# Altium schematic sheet STC12C5A60S2 DEMO R1A.SchDoc
size A3
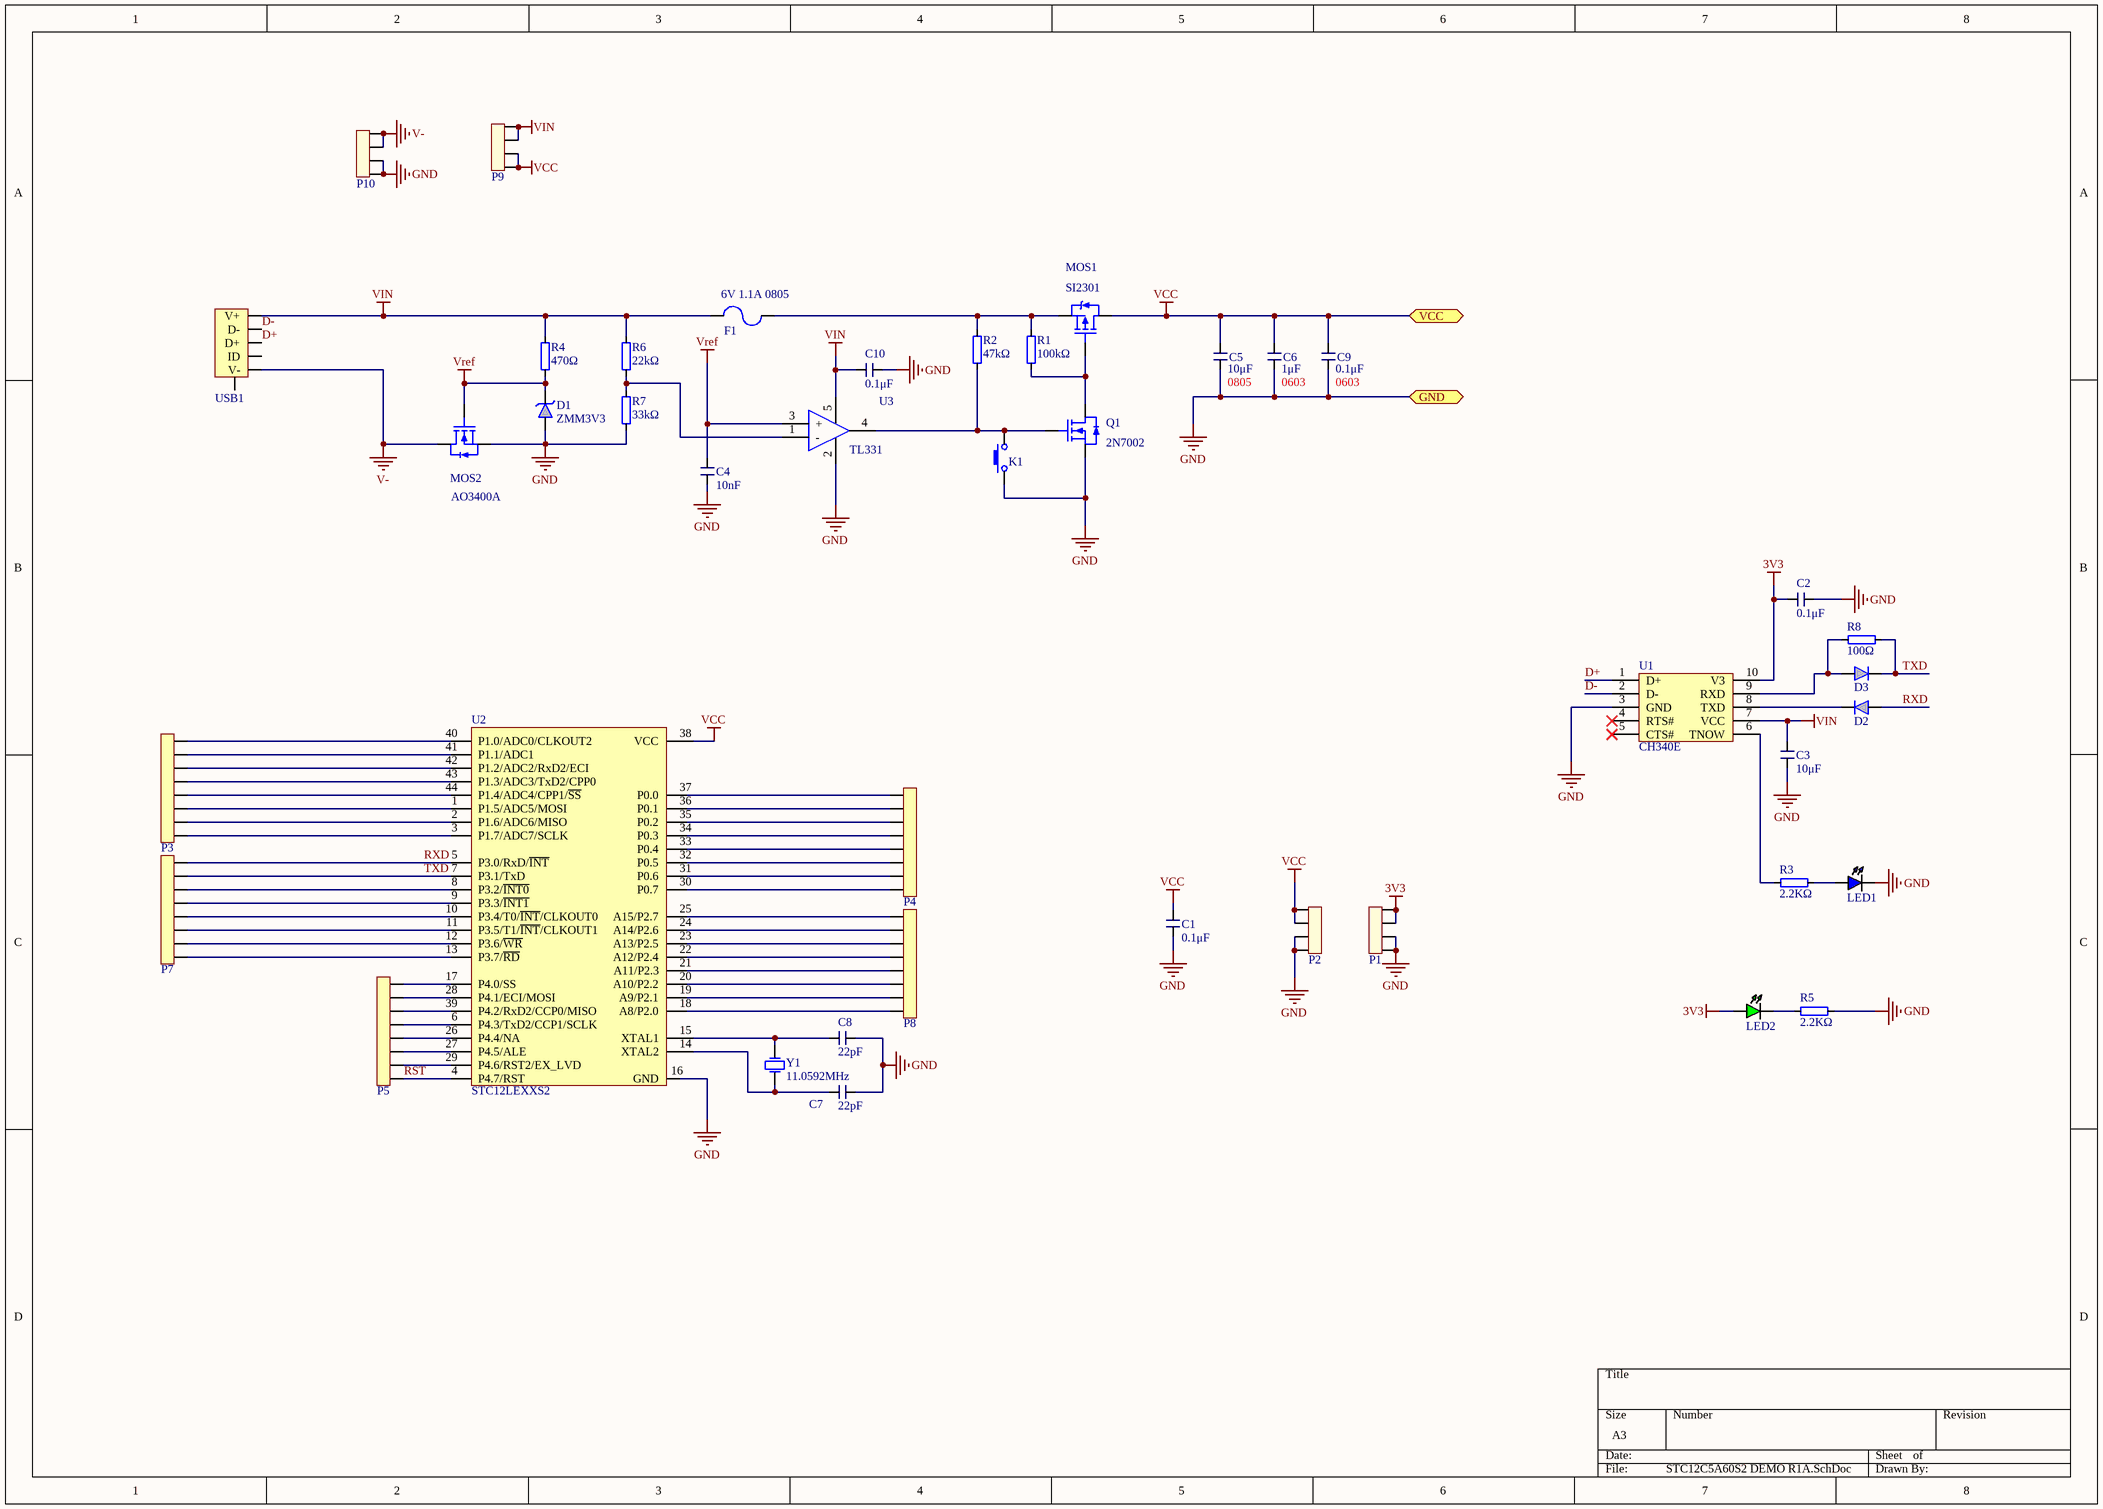
[diagram p0: STC12C5A60S2 DEMO R1A.SchDoc]

## Parts
C1  0.1μF  [C_0603]
C2  0.1μF  [C_0603]
C3  10μF  [C_0603]
C4  10nF  [C_0603]
C5  10μF  [C_0805]
C6  1μF  [C_0603]
C7  22pF  [C_0603]
C8  22pF  [C_0603]
C9  0.1μF  [C_0603]
C10  0.1μF  [C_0603]
D1  ZMM3V3  [SOD_80]
D2  1N4148WS  [SOD_323]  (value not drawn)
D3  1N4148WS  [SOD_323]  (value not drawn)
F1  6V 1.1A 0805  [FB_0805]
K1  TACT SWITCH_2_SMD  [TACT SWITCH_2_SMD]  (value not drawn)
LED1  LED_0603-B  [LED_0603-B]  (value not drawn)
LED2  LED_0603-G  [LED_0603-G]  (value not drawn)
MOS1  SI2301  [SOT_23_3]
MOS2  AO3400A  [SOT_23_3]
P1  PIN4  [PIN_4]  (value not drawn)
P2  PIN4  [PIN_4]  (value not drawn)
P3  PIN8  [PIN_8]  (value not drawn)
P4  PIN8  [PIN_8]  (value not drawn)
P5  PIN8  [PIN_8]  (value not drawn)
P7  PIN8  [PIN_8]  (value not drawn)
P8  PIN8  [PIN_8]  (value not drawn)
P9  PIN4  [PIN_4]  (value not drawn)
P10  PIN4  [PIN_4]  (value not drawn)
Q1  2N7002  [SOT_23_3]
R1  100kΩ  [R_0603]
R2  47kΩ  [R_0603]
R3  2.2KΩ  [R_0603]
R4  470Ω  [R_0603]
R5  2.2KΩ  [R_0603]
R6  22kΩ  [R_0603]
R7  33kΩ  [R_0603]
R8  100Ω  [R_0603]
U1  CH340E  [MSOP_10]
U2  STC12LEXXS2  [LQFP_44]
U3  TL331  [SOT_23_5]
USB1  MICRO USB B  [MICRO USB B]  (value not drawn)
Y1  11.0592MHz  [Crystal_HC_49US]

## Ports
GND, VCC

## Nets
3V3: C2.2 LED2.1 P1.3 P1.4 U1.10(V3)
GND: C1.2 C2.1 C3.1 C4.2 C5.2 C6.2 C7.2 C8.2 C9.2 C10.2 D1.1(A) K1.1 LED1.2 MOS2.2(S) P1.1 P1.2 P2.1 P2.2 P10.3 P10.4 Q1.2(S) R5.2 R7.1 U1.3(GND) U2.16(GND) U3.2(GND) ; port GND
V-: MOS2.3(D) P10.1 P10.2 USB1.5(V-)
VCC: C1.1 C5.1 C6.1 C9.1 MOS1.3(D) P2.3 P2.4 P9.3 P9.4 U2.38(VCC) ; port VCC
VIN: C3.2 C10.1 F1.1 P9.1 P9.2 R4.2 R6.2 U1.7(VCC) U3.5(VCC) USB1.1(V+)
Vref: C4.1 D1.2(K) MOS2.1(G) R4.1 U3.3(+)
D+: U1.1(D+) USB1.3(D+)
D-: U1.2(D-) USB1.2(D-)
RST: P5.8 U2.4(P4.7/RST)
RXD: D2.1(A) P7.1 U2.5(P3.0/RxD/~{INT})
TXD: D3.2(K) P7.2 R8.2 U2.7(P3.1/TxD)
NetC7_1: C7.1 U2.14(XTAL2) Y1.1(OSC1)
NetC8_1: C8.1 U2.15(XTAL1) Y1.2(OSC2)
NetD2_2: D2.2(K) U1.8(TXD)
NetD3_1: D3.1(A) R8.1 U1.9(RXD)
NetF1_2: F1.2 MOS1.2(S) R1.2 R2.2
NetK1_2: K1.2 Q1.1(G) R2.1 U3.4(OUT)
NetLED1_1: LED1.1 R3.2
NetLED2_2: LED2.2 R5.1
NetMOS1_1: MOS1.1(G) Q1.3(D) R1.1
NetP3_1: P3.1 U2.40(P1.0/ADC0/CLKOUT2)
NetP3_2: P3.2 U2.41(P1.1/ADC1)
NetP3_3: P3.3 U2.42(P1.2/ADC2/RxD2/ECI)
NetP3_4: P3.4 U2.43(P1.3/ADC3/TxD2/CPP0)
NetP3_5: P3.5 U2.44(P1.4/ADC4/CPP1/~{SS})
NetP3_6: P3.6 U2.1(P1.5/ADC5/MOSI)
NetP3_7: P3.7 U2.2(P1.6/ADC6/MISO)
NetP3_8: P3.8 U2.3(P1.7/ADC7/SCLK)
NetP4_1: P4.1 U2.30(P0.7)
NetP4_2: P4.2 U2.31(P0.6)
NetP4_3: P4.3 U2.32(P0.5)
NetP4_4: P4.4 U2.33(P0.4)
NetP4_5: P4.5 U2.34(P0.3)
NetP4_6: P4.6 U2.35(P0.2)
NetP4_7: P4.7 U2.36(P0.1)
NetP4_8: P4.8 U2.37(P0.0)
NetP5_1: P5.1 U2.17(P4.0/SS)
NetP5_2: P5.2 U2.28(P4.1/ECI/MOSI)
NetP5_3: P5.3 U2.39(P4.2/RxD2/CCP0/MISO)
NetP5_4: P5.4 U2.6(P4.3/TxD2/CCP1/SCLK)
NetP5_5: P5.5 U2.26(P4.4/NA)
NetP5_6: P5.6 U2.27(P4.5/ALE)
NetP5_7: P5.7 U2.29(P4.6/RST2/EX_LVD)
NetP7_3: P7.3 U2.8(P3.2/~{INT0})
NetP7_4: P7.4 U2.9(P3.3/~{INT1})
NetP7_5: P7.5 U2.10(P3.4/T0/~{INT}/CLKOUT0)
NetP7_6: P7.6 U2.11(P3.5/T1/~{INT}/CLKOUT1)
NetP7_7: P7.7 U2.12(P3.6/~{WR})
NetP7_8: P7.8 U2.13(P3.7/~{RD})
NetP8_1: P8.1 U2.18(A8/P2.0)
NetP8_2: P8.2 U2.19(A9/P2.1)
NetP8_3: P8.3 U2.20(A10/P2.2)
NetP8_4: P8.4 U2.21(A11/P2.3)
NetP8_5: P8.5 U2.22(A12/P2.4)
NetP8_6: P8.6 U2.23(A13/P2.5)
NetP8_7: P8.7 U2.24(A14/P2.6)
NetP8_8: P8.8 U2.25(A15/P2.7)
NetR3_1: R3.1 U1.6(TNOW)
NetR6_1: R6.1 R7.2 U3.1(-)

Not connected (* = marked no-connect by the designer): U1 4(RTS#)* 5(CTS#)*; USB1 0(GND) 4(ID)

## Notes on the sheet
- 0805
- 0603
- (near C9) 0603

## Library data of the parts
C1-C4 C6-C10 = C_0603
C5 = C_0805
D1 = ZMMxxV
F1 = FUSE_0805
R1-R8 = R_0603
U2 = STC12LE5AXXS2 - LQPF44
Y1 = Crystal_HC_49US